# Altium schematic sheet MCU.SchDoc
size A; SheetNumber: 3; SheetTotal: 7
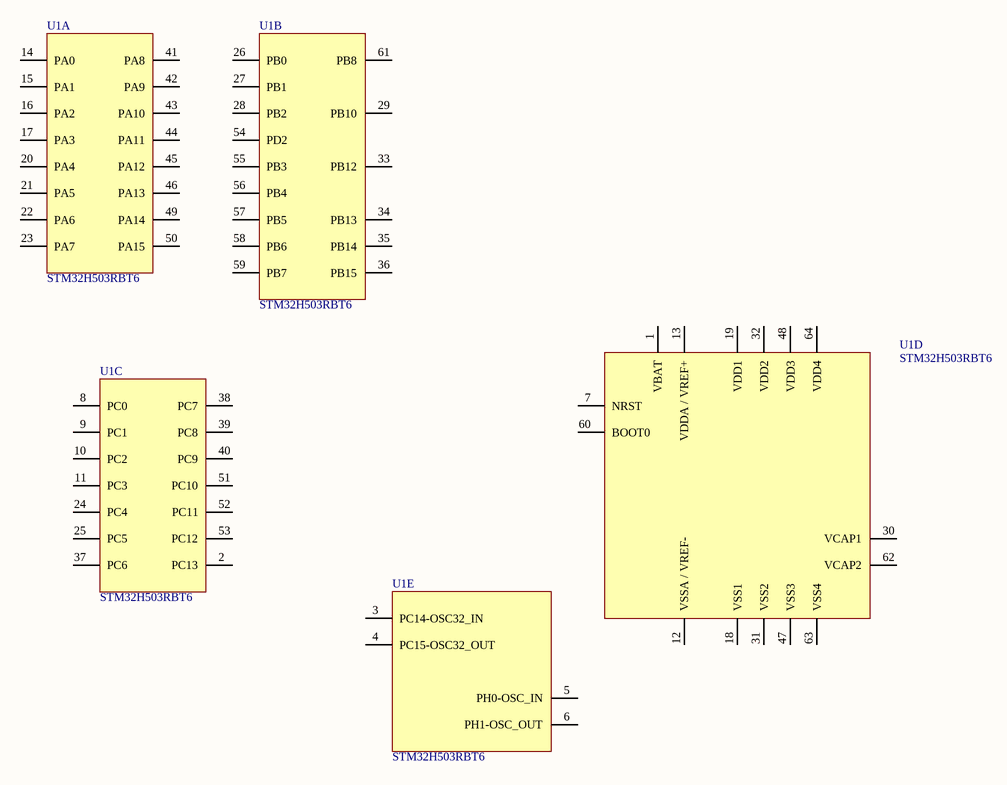
[diagram p0: MCU.SchDoc]

## Parts
U1  STM32H503RBT6  [QFP64P50_1200X1200X160L60X22N]  (parts A,B,C,D,E of 5)

## Nets

Not connected (* = marked no-connect by the designer): U1 1(VBAT) 2(PC13) 3(PC14-OSC32_IN) 4(PC15-OSC32_OUT) 5(PH0-OSC_IN) 6(PH1-OSC_OUT) 7(NRST) 8(PC0) 9(PC1) 10(PC2) 11(PC3) 12(VSSA_/_VREF-) 13(VDDA_/_VREF+) 14(PA0) 15(PA1) 16(PA2) 17(PA3) 18(VSS1) 19(VDD1) 20(PA4) 21(PA5) 22(PA6) 23(PA7) 24(PC4) 25(PC5) 26(PB0) 27(PB1) 28(PB2) 29(PB10) 30(VCAP1) 31(VSS2) 32(VDD2) 33(PB12) 34(PB13) 35(PB14) 36(PB15) 37(PC6) 38(PC7) 39(PC8) 40(PC9) 41(PA8) 42(PA9) 43(PA10) 44(PA11) 45(PA12) 46(PA13) 47(VSS3) 48(VDD3) 49(PA14) 50(PA15) 51(PC10) 52(PC11) 53(PC12) 54(PD2) 55(PB3) 56(PB4) 57(PB5) 58(PB6) 59(PB7) 60(BOOT0) 61(PB8) 62(VCAP2) 63(VSS4) 64(VDD4)

## Library data of the parts
U1 = STM32H503RBT6: RISC Microcontroller, 32-Bit, FLASH, CORTEX-M4F CPU, 180MHz, CMOS, PBGA216; Manufacturer: STMicroelectronics; Supplier: LCSC; Supplier Part Number: C6807804; Manufacturer Part Number: STM32H503RBT6; RoHS: Compliant; Category: Microcontrollers; Stock: 883; Pricing: 1=3.5339, 10=3.0062, 30=2.6936, 160=2.3779, 480=2.2319, 960=2.1659 (USD); Country of Origin: Mainland China, Taiwan; Export Control Classification Number (ECCN) Code: 3A991.A.2; Harmonized Tariff Schedule (HTS) Code: 8542.31.00.30; Lifecycle Status: Production; REACH SVHC: Yes; ComponentLink1URL: https://datasheet.octopart.com:443/STM32H503RBT6-STMicroelectronics-datasheet-188928330.pdf?src-supplier=TME; ComponentLink1Description: https://datasheet.octopart.com:443/STM32H503RBT6-STMicroelectronics-datasheet-188928330.pdf?src-supplier=TME